# Altium project NANORACK_LASER.PrjPcb
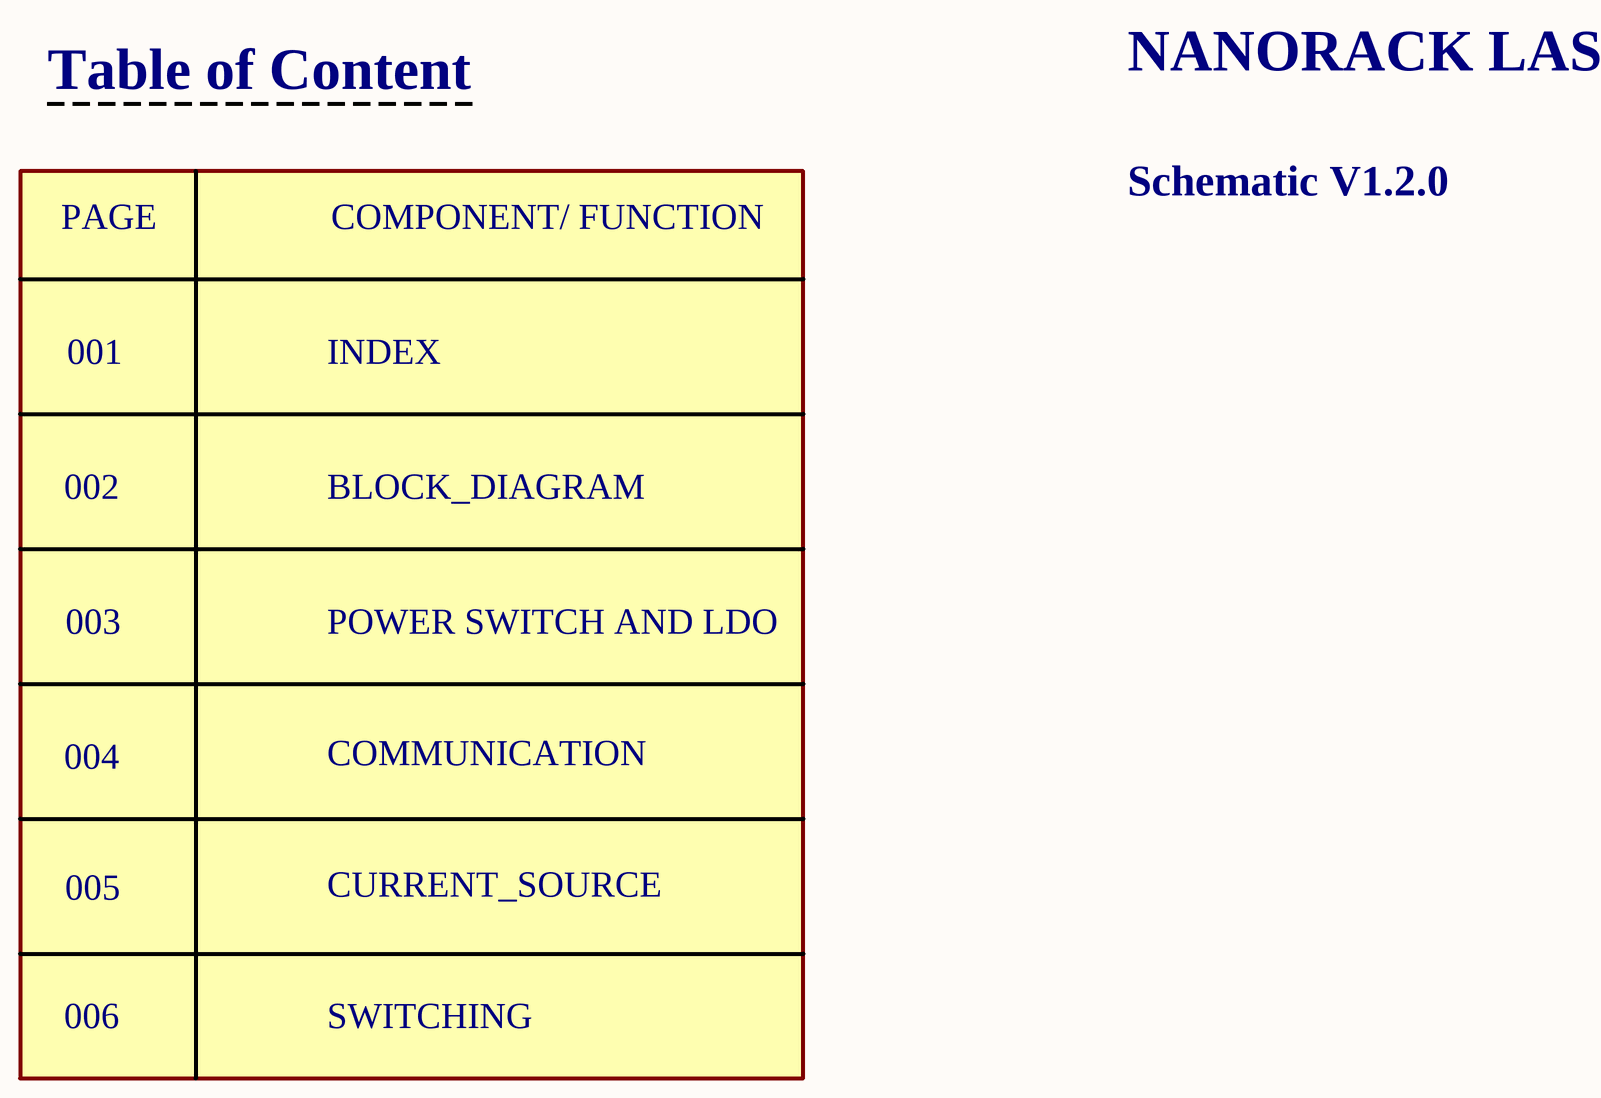
[diagram p0: INDEX.SchDoc]
6 sheets, 191 parts. Net scope: global (net labels, ports and power ports of the same name join across sheets).
Board file: LASERDIODE_V1.2.0.PcbDoc
Sheets:
  INDEX.SchDoc
  BLOCK_DIAGRAM.SchDoc
  POWER SWITCH AND LDO.SchDoc
  COMMUNICATION.SchDoc
  CURRENT_SOURCE.SchDoc
  SWITCHING.SchDoc

## Sheet INDEX.SchDoc
size 420 x 297 mm; SheetNumber: 1; SheetTotal: 6

### Notes on the sheet
- Table of Content
- NANORACK LASER
- PAGE
- COMPONENT/ FUNCTION
- Schematic V1.2.0
- 001
- INDEX
- 002
- BLOCK_DIAGRAM
- 003
- POWER SWITCH AND LDO
- 004
- COMMUNICATION
- 005
- CURRENT_SOURCE
- 006
- SWITCHING
- Project:
- BEE-PC1
- Sub-system:
- Design by:
- Hung Nguyen D.
- Bao Bui Q.
- Sheet title:
- Sheet
- A3
- of
- Checked by:
- Approved by:
- Vu Pham
- Revision:
- Document No:
- V1.2.0
- Size:
- Date:

## Sheet BLOCK_DIAGRAM.SchDoc
size 420 x 297 mm; SheetNumber: 2; SheetTotal: 6

### Notes on the sheet
- Project:
- BEE-PC1
- Sub-system:
- Design by:
- Hung Nguyen D.
- Bao Bui Q.
- Sheet title:
- Sheet
- A3
- of
- Checked by:
- Approved by:
- Vu Pham
- Revision:
- Document No:
- V1.2.0
- Size:
- Date:
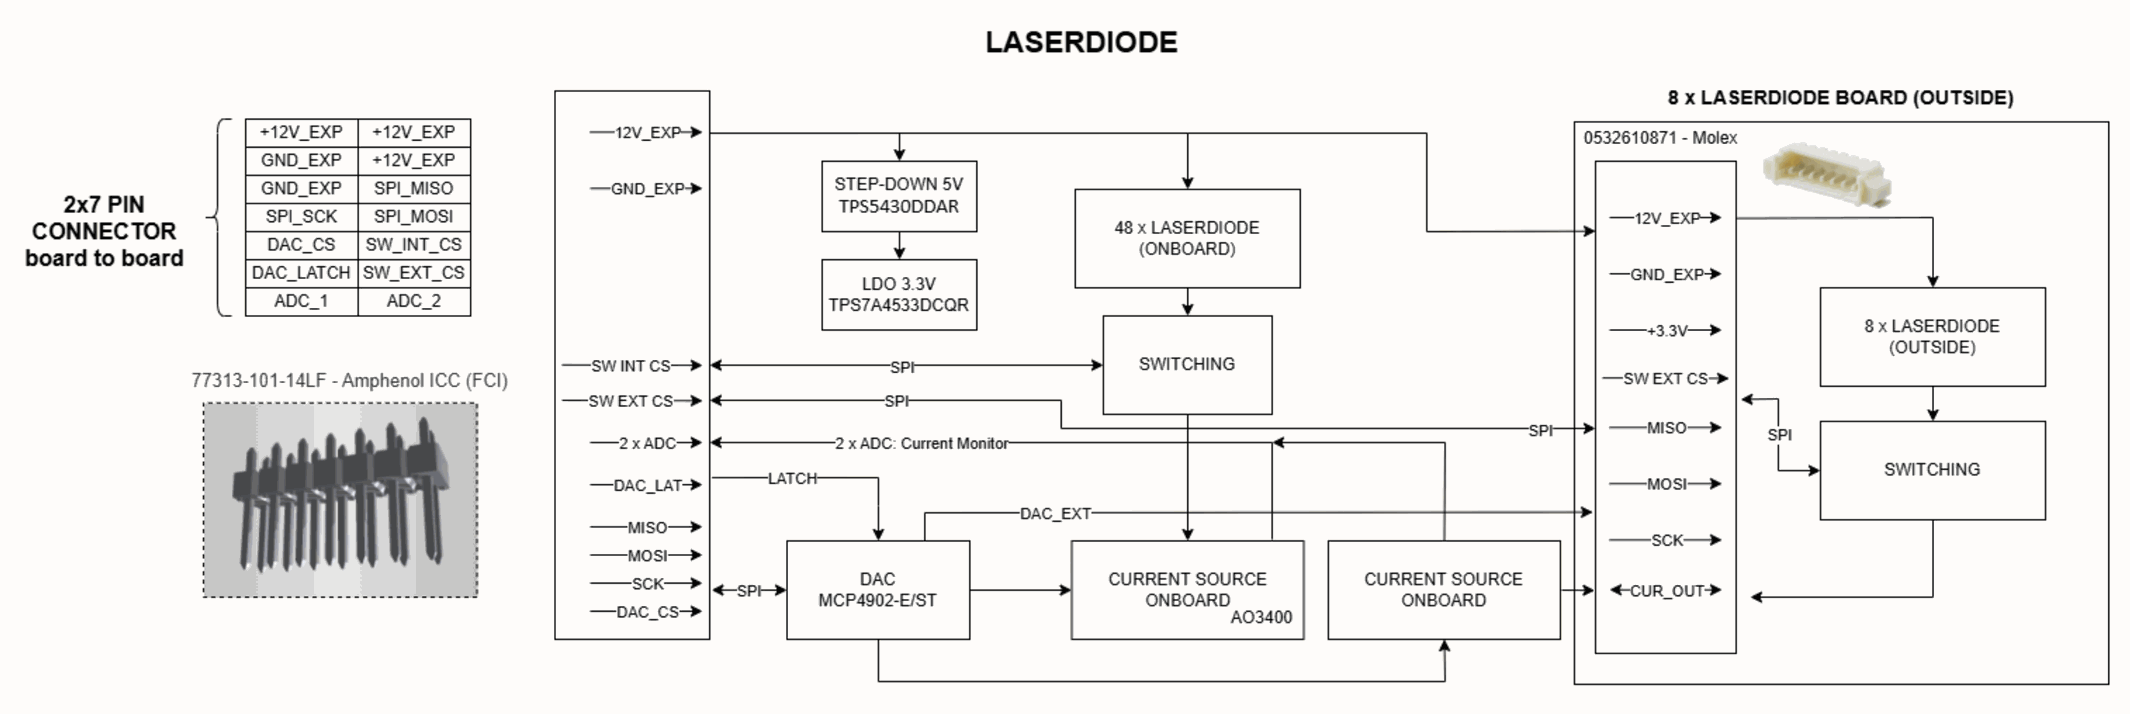
[diagram p1: BLOCK_DIAGRAM.SchDoc]

## Sheet POWER SWITCH AND LDO.SchDoc
size 420 x 297 mm; SheetNumber: 3; SheetTotal: 6
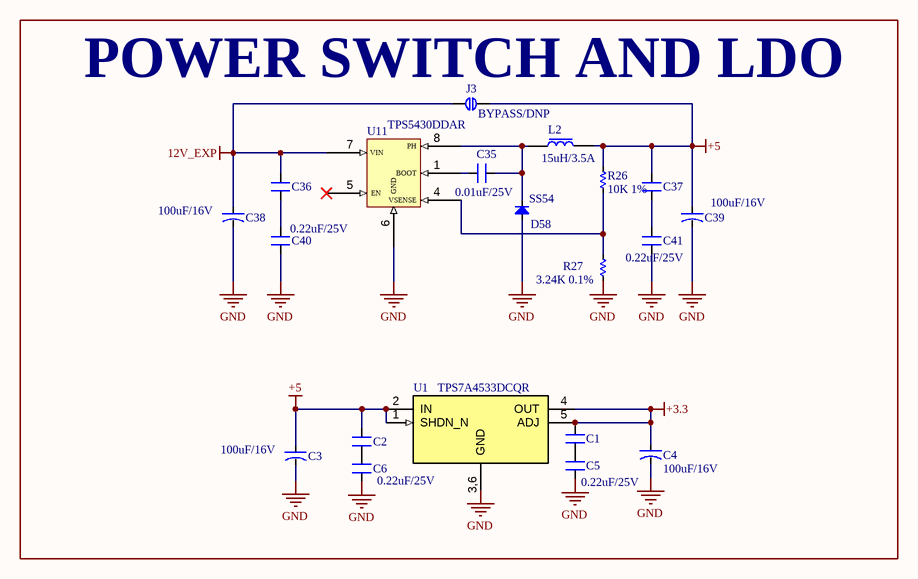
[diagram p2: POWER SWITCH AND LDO.SchDoc]

### Parts
C1  0.22uF/25V  [SM-0603]  (value not drawn)
C2  0.22uF/25V  [SM-0603]
C3  100uF/16V  [CAP TANT 2312]
C4  100uF/16V  [CAP TANT 2312]
C5  0.22uF/25V  [SM-0603]
C6  0.22uF/25V  [SM-0603]  (value not drawn)
C35  0.01uF/25V  [SM-0603]
C36  0.22uF/25V  [SM-0603]  (value not drawn)
C37  0.22uF/25V  [SM-0603]  (value not drawn)
C38  100uF/16V  [CAP TANT 2312]
C39  100uF/16V  [CAP TANT 2312]
C40  0.22uF/25V  [SM-0603]
C41  0.22uF/25V  [SM-0603]
D58  SS54  [DIO-SMD-A]
J3  BYPASS/DNP  [BIG_CONNECTOR]
L2  15uH/3.5A  [SRP7050TA]
R26  10K 1%  [RES-SMD-0603]
R27  3.24K 0.1%  [RES-SMD-0603]
U1  TPS7A4533DCQR  [SOT223-6]
U11  TPS5430DDAR  [HSOP8]

### Blocks framed on the sheet
POWER SWITCH AND LDO: C1-C6 C35-C41 D58 J3 L2 R26 R27 U1 U11

### Nets
12V_EXP: C36.2 C38.1 J3.1 U11.7(VIN)
+3.3: C1.2 C4.1 U1.4(OUT) U1.5(ADJ)
+5: C2.2 C3.1 C37.2 C39.1 J3.2 L2.2 R26.2 U1.1(SHDN_N) U1.2(IN)
GND: C3.2 C4.2 C5.1 C6.1 C38.2 C39.2 C40.1 C41.1 D58.1(A) R27.1 U1.3,6(GND) U11.6(GND)
NetC1_1: C1.1 C5.2
NetC2_1: C2.1 C6.2
NetC35_1: C35.1 D58.2(K) L2.1 U11.8(PH)
NetC35_2: C35.2 U11.1(BOOT)
NetC36_1: C36.1 C40.2
NetC37_1: C37.1 C41.2
NetR26_1: R26.1 R27.2 U11.4(VSENSE)

Not connected (* = marked no-connect by the designer): U11 5(EN)*

### Notes on the sheet
- Project:
- BEE-PC1
- Sub-system:
- Design by:
- Hung Nguyen D.
- Bao Bui Q.
- Sheet title:
- Sheet
- A3
- of
- Checked by:
- Approved by:
- Vu Pham
- Revision:
- Document No:
- V1.2.0
- Size:
- Date:

### Library data of the parts
C1 C2 C5 C6 C35-C37 C40 C41 = CM: 0603; Value: 103
C3 C4 C38 C39 = CN-ALU-SMD: Polarized Capacitor (Axial); Published: 8-Jun-2000; LatestRevisionDate: 17-Jul-2002; LatestRevisionNote: Re-released for DXP Platform.; PackageReference: POLAR0.8; Publisher: Altium Limited
D58 = Diode SMD: DIODE SCHOTTKY 40V 5A SMA; Code - JEDEC: DO-214-AB; Value: 1N5007; Published: 8-Jun-2000; Revision: July-2002: Re-released for DXP Platform.; Publisher: Altium Limited
J3 = CNT: DNP
L2 = INDUCTOR: SRP7050TA-150M
R26 = Res-SMD: 0603; Manufacturer: Generic Components; Class: Passive; Published: 08/06/2000; Publisher: Altium Hobart Technology Centre
R27 = Res-SMD: ERA-3AEB3241V; Manufacturer: Generic Components; Class: Passive; Published: 08/06/2000; Publisher: Altium Hobart Technology Centre
U1 = TPS7A4533DCQR: IC REG LINEAR 3.3V 1.5A SOT223-6
U11 = TPS543X: 8SOP; pin to pad: 6>6+9

## Sheet COMMUNICATION.SchDoc
size 420 x 297 mm; SheetNumber: 4; SheetTotal: 6
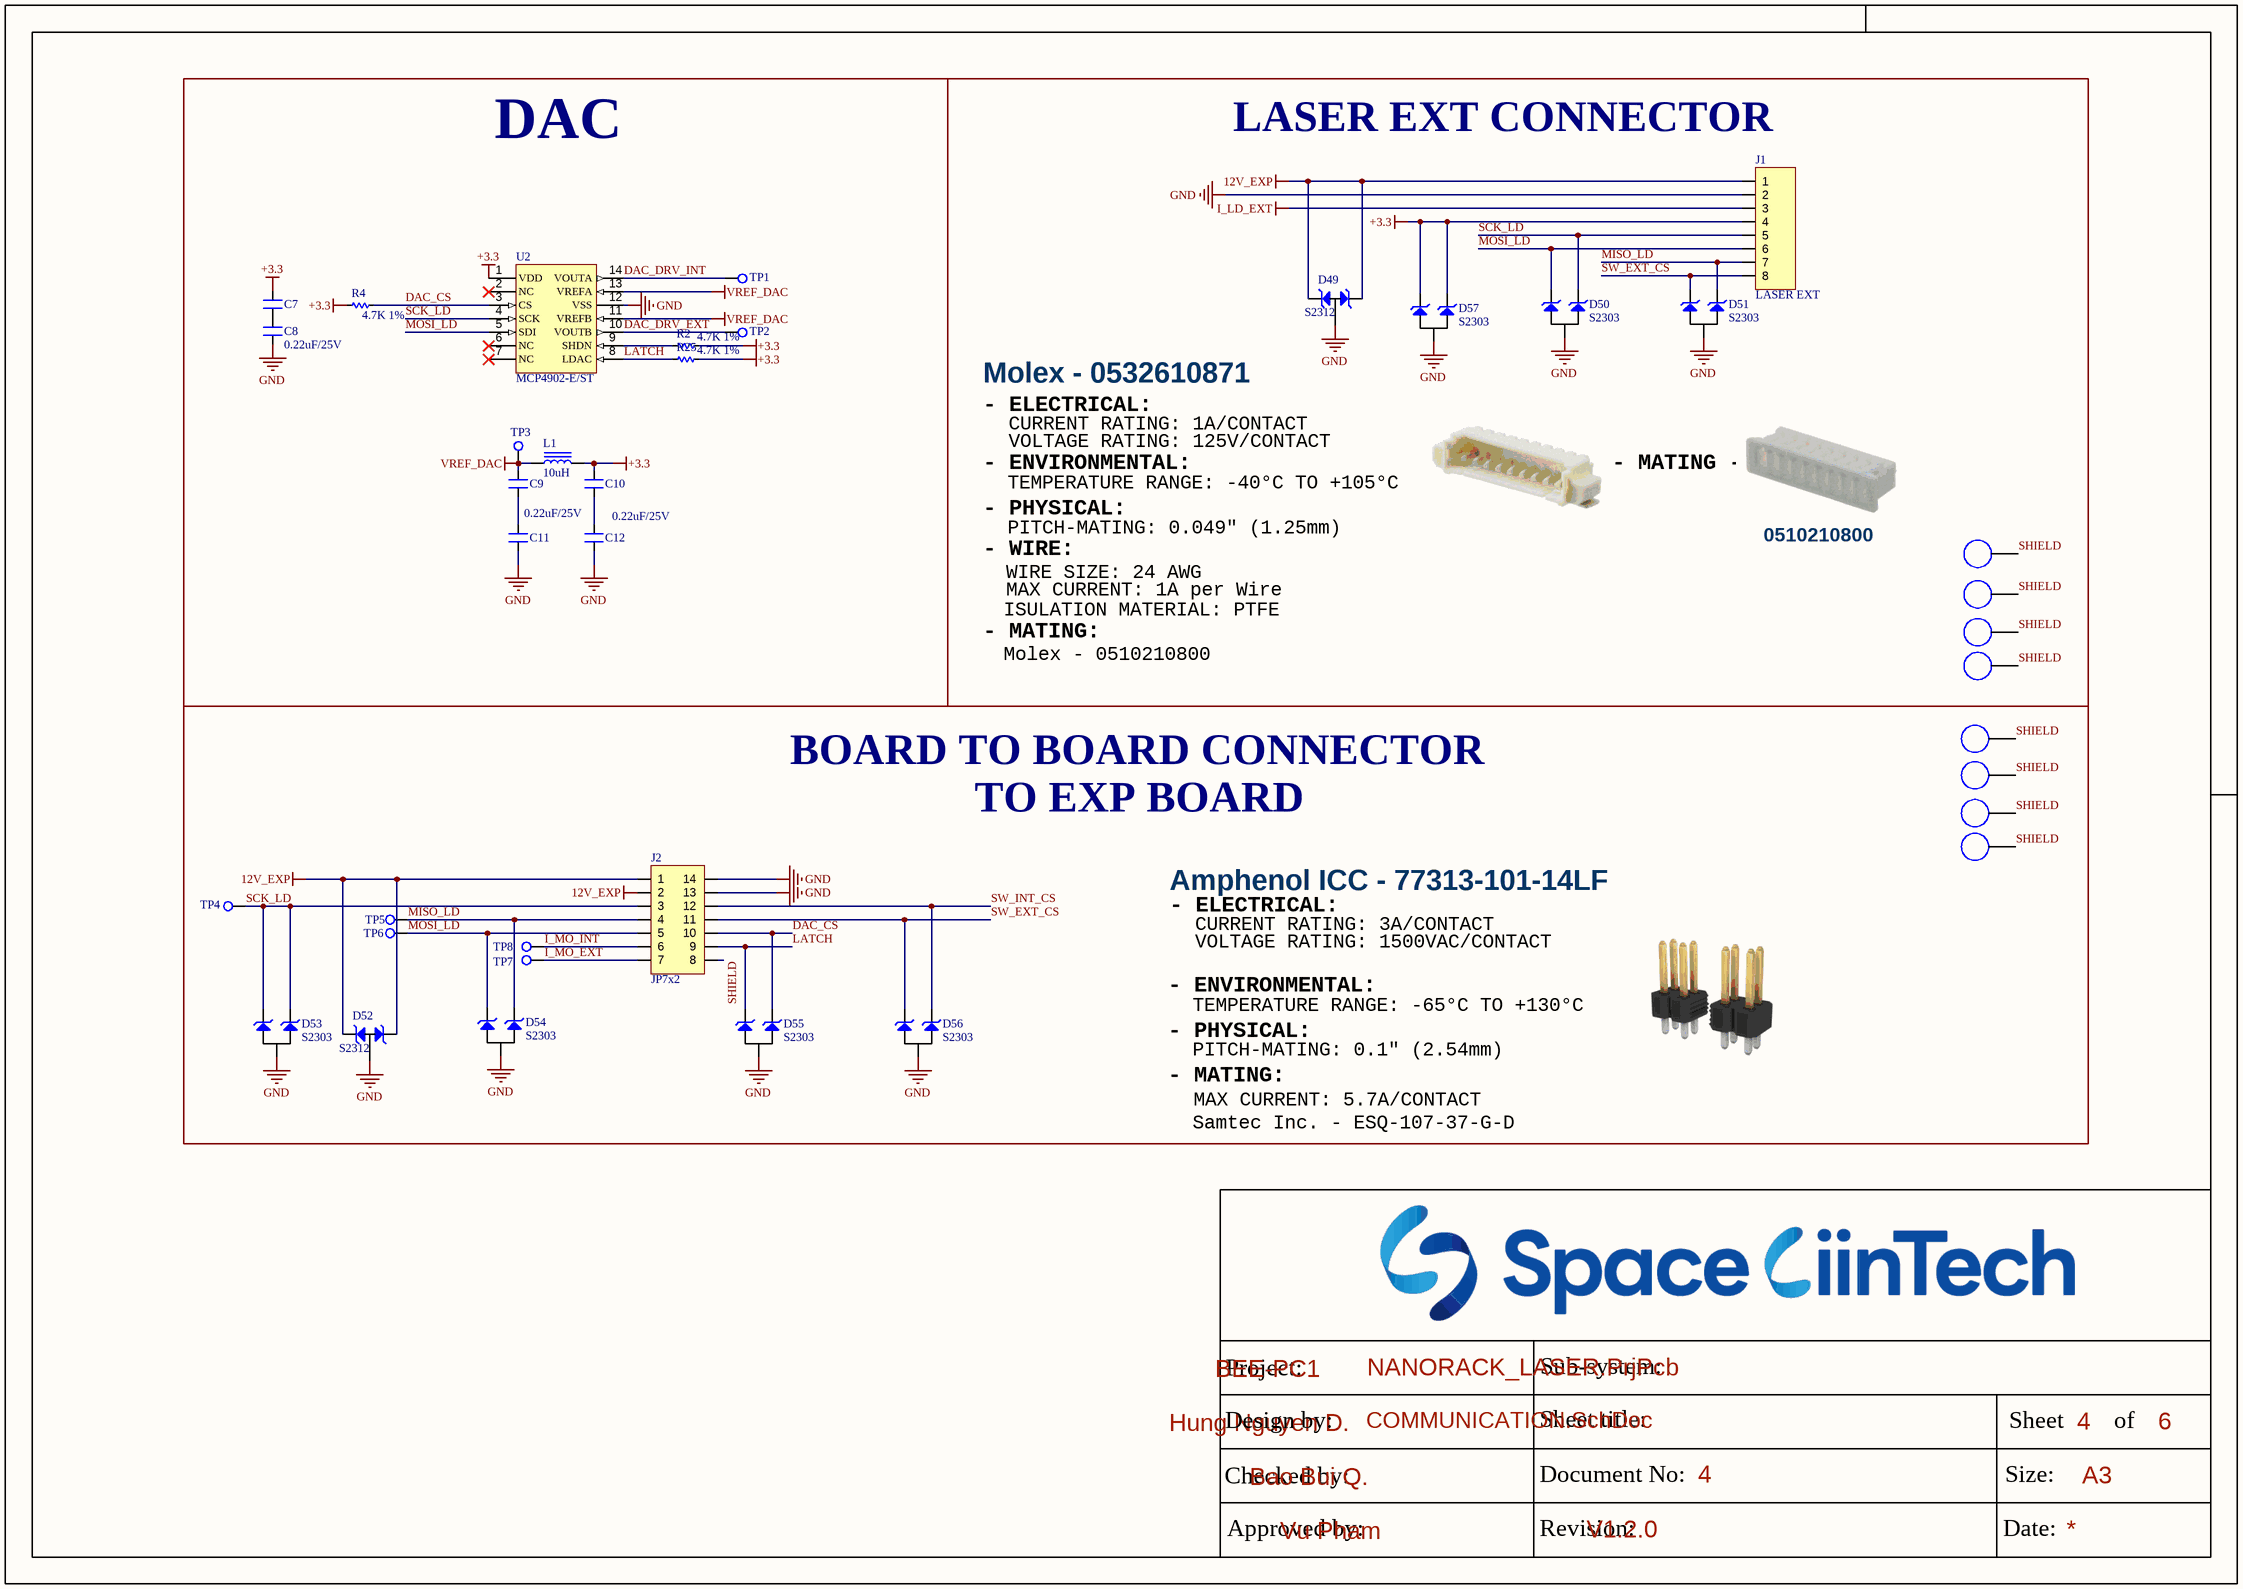
[diagram p3: COMMUNICATION.SchDoc]

### Parts
C7  0.22uF/25V  [SM-0603]  (value not drawn)
C8  0.22uF/25V  [SM-0603]
C9  0.22uF/25V  [SM-0603]  (value not drawn)
C10  0.22uF/25V  [SM-0603]  (value not drawn)
C11  0.22uF/25V  [SM-0603]
C12  0.22uF/25V  [SM-0603]
D49  S2312  [SOT23-123]
D50  S2303  [SOT23-123]
D51  S2303  [SOT23-123]
D52  S2312  [SOT23-123]
D53  S2303  [SOT23-123]
D54  S2303  [SOT23-123]
D55  S2303  [SOT23-123]
D56  S2303  [SOT23-123]
D57  S2303  [SOT23-123]
H1  HOLD  [M3]  (value not drawn)
H2  HOLD  [M3]  (value not drawn)
H3  HOLD  [M3]  (value not drawn)
H4  HOLD  [M3]  (value not drawn)
H5  HOLD  [M3]  (value not drawn)
H6  HOLD  [M3]  (value not drawn)
H7  HOLD  [M3]  (value not drawn)
H8  HOLD  [M3]  (value not drawn)
J1  LASER EXT  [0532610871]
J2  JP7x2  [JP7-D2T]
L1  10uH  [FER 0805/2012]
R2  4.7K 1%  [RES-SMD-0603]
R4  4.7K 1%  [RES-SMD-0603]
R25  4.7K 1%  [RES-SMD-0603]
TP1  Test_Point  [TESTPOINT]  (value not drawn)
TP2  Test_Point  [TESTPOINT]  (value not drawn)
TP3  Test_Point  [TESTPOINT]  (value not drawn)
TP4  Test_Point  [TESTPOINT]  (value not drawn)
TP5  Test_Point  [TESTPOINT]  (value not drawn)
TP6  Test_Point  [TESTPOINT]  (value not drawn)
TP7  Test_Point  [TESTPOINT]  (value not drawn)
TP8  Test_Point  [TESTPOINT]  (value not drawn)
U2  MCP4902-E/ST  [TSSOP14]

### Blocks framed on the sheet
DAC: C7-C12 L1 R2 R4 R25 TP1-TP3 U2
LASER EXT CONNECTOR: D49-D51 D57 H1-H3 H8 J1

### Nets
12V_EXP: D49.1 D49.3 D52.1 D52.3 J1.1 J2.1 J2.2
+3.3: C7.2 C10.2 D57.1 D57.3 J1.4 L1.2 R2.1 R4.2 R25.1 U2.1(VDD)
GND: C8.1 C11.1 C12.1 D49.2 D50.2 D51.2 D52.2 D53.2 D54.2 D55.2 D56.2 D57.2 J1.2 J2.13 J2.14 U2.12(VSS)
I_LD_EXT: J1.3
VREF_DAC: C9.2 L1.1 TP3.1 U2.11(VREFB) U2.13(VREFA)
DAC_CS: D55.3 J2.10 R4.1 U2.3(CS)
DAC_DRV_EXT: TP2.1 U2.10(VOUTB)
DAC_DRV_INT: TP1.1 U2.14(VOUTA)
I_MO_EXT: J2.7 TP7.1
I_MO_INT: J2.6 TP8.1
LATCH: D55.1 J2.9 R25.2 U2.8(LDAC)
MISO_LD: D51.3 D54.3 J1.7 J2.4 TP5.1
MOSI_LD: D50.1 D54.1 J1.6 J2.5 TP6.1 U2.5(SDI)
SCK_LD: D50.3 D53.1 D53.3 J1.5 J2.3 TP4.1 U2.4(SCK)
SHIELD: H1.1 H2.1 H3.1 H4.1 H5.1 H6.1 H7.1 H8.1 J2.8
SW_EXT_CS: D51.1 D56.1 J1.8 J2.11
SW_INT_CS: D56.3 J2.12
NetC7_1: C7.1 C8.2
NetC9_1: C9.1 C11.2
NetC10_1: C10.1 C12.2
NetR2_2: R2.2 U2.9(SHDN)

Not connected (* = marked no-connect by the designer): U2 2(NC)* 6(NC)* 7(NC)*

### Notes on the sheet
- Molex - 0532610871
- - ELECTRICAL:
- CURRENT RATING: 1A/CONTACT
- VOLTAGE RATING: 125V/CONTACT
- - ENVIRONMENTAL:
- - PHYSICAL:
- TEMPERATURE RANGE: -40°C TO +105°C
- - MATING -
- - WIRE:
- WIRE SIZE: 24 AWG
- MAX CURRENT: 1A per Wire
- PITCH-MATING: 0.049" (1.25mm)
- 0510210800
- - MATING:
- ISULATION MATERIAL: PTFE
- Molex - 0510210800
- BOARD TO BOARD CONNECTOR
- TO EXP BOARD
- Amphenol ICC - 77313-101-14LF
- CURRENT RATING: 3A/CONTACT
- VOLTAGE RATING: 1500VAC/CONTACT
- TEMPERATURE RANGE: -65°C TO +130°C
- PITCH-MATING: 0.1" (2.54mm)
- Samtec Inc. - ESQ-107-37-G-D
- MAX CURRENT: 5.7A/CONTACT
- Project:
- BEE-PC1
- Sub-system:
- Design by:
- Hung Nguyen D.
- Bao Bui Q.
- Sheet title:
- Sheet
- A3
- of
- Checked by:
- Approved by:
- Vu Pham
- Revision:
- Document No:
- V1.2.0
- Size:
- Date:

### Library data of the parts
C7-C12 = CM: 0603; Value: 103
D49 D52 = S2315: TVS DIODE 12VWM 19VC SOT23, P/N:  S2312
D50 D51 D53-D57 = S2303: TVS DIODE 3.3VWM 8VC SOT23, P/N: / S2303
H1-H8 = PAD_HOLD
J1 = JP8: WR-PHD 2.54 mm Angled Socket Header; Manufacturer: W¨¹rth Elektronik eiSos GmbH; partNo: 613008143121; ComponentLink1 Description: Manufacturer; ComponentLink2 Description: Datasheet; NoPins: 08; Created Date: 29 March 2013; ComponentLink1URL: http://www.we-online.com; ComponentLink2URL: http://katalog.we-online.de/em/datasheet/6130xx143121.pdf; Created by: Karrer Zheng
J2 = JP7x2: WR-PHD 2.54 mm Dual Socket Header; Manufacturer: W¨¹rth Elektronik eiSos GmbH; partNo: 61301421821; ComponentLink1 Description: Manufacturer; ComponentLink2 Description: Datasheet; NoPins: 14; Created Date: 29 March 2013; ComponentLink1URL: http://www.we-online.com; ComponentLink2URL: http://katalog.we-online.de/em/datasheet/6130xx21821.pdf; Created by: Karrer Zheng
L1 = Inductor: MLZ1608N100LT000; Value: 1.5uH
R2 R4 R25 = Res-SMD: as R26 on sheet POWER SWITCH AND LDO; Published: 08/06/2000; Publisher: Altium Hobart Technology Centre
U2 = MCP4902: IC DAC 8BIT V-OUT 14TSSOP

## Sheet CURRENT_SOURCE.SchDoc
size 420 x 297 mm; SheetNumber: 5; SheetTotal: 6
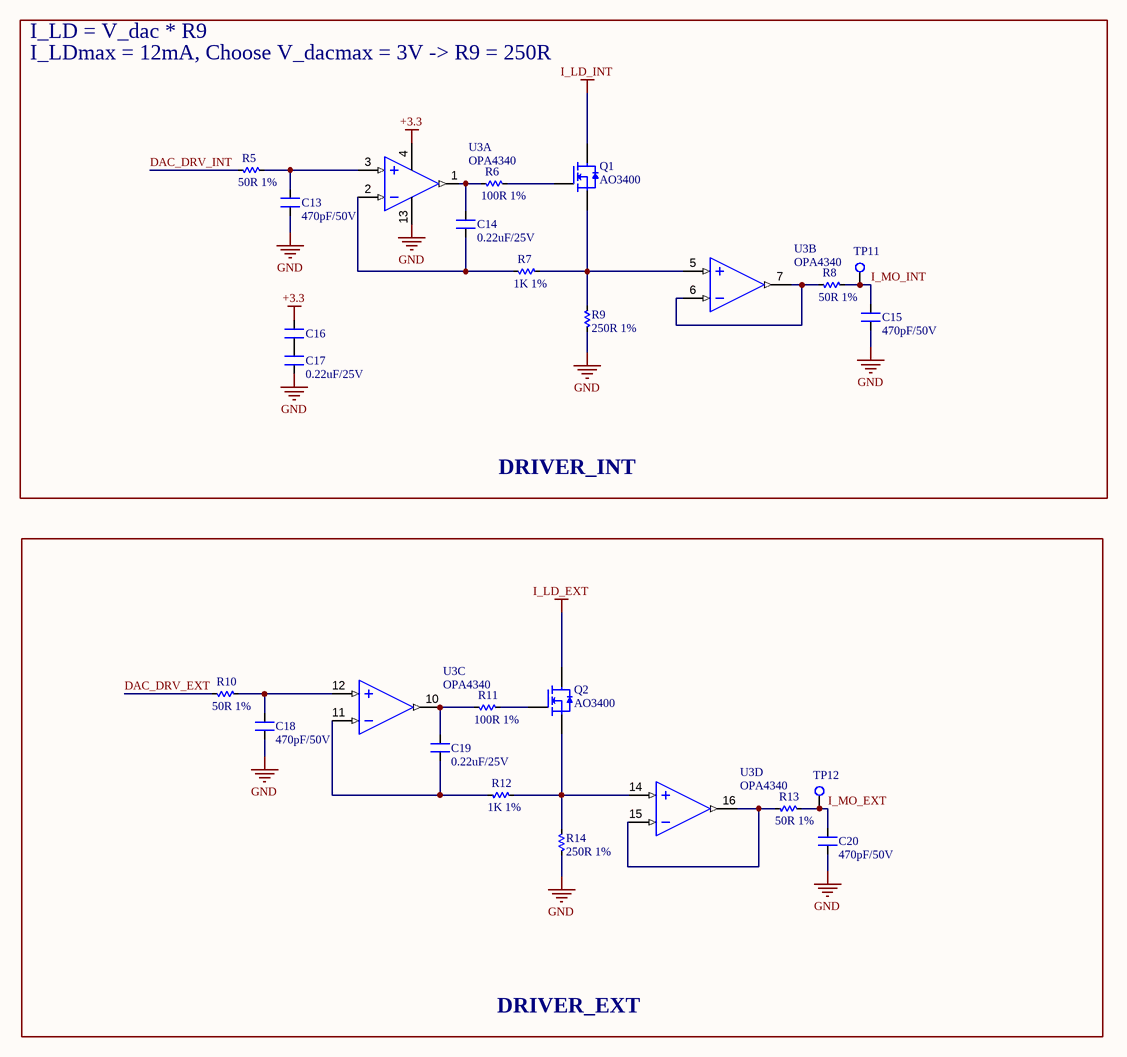
[diagram p4: CURRENT_SOURCE.SchDoc]

### Parts
C13  470pF/50V  [SM-0603]
C14  0.22uF/25V  [SM-0603]
C15  470pF/50V  [SM-0603]
C16  0.22uF/25V  [SM-0603]  (value not drawn)
C17  0.22uF/25V  [SM-0603]
C18  470pF/50V  [SM-0603]
C19  0.22uF/25V  [SM-0603]
C20  470pF/50V  [SM-0603]
Q1  AO3400  [SOT23-132]
Q2  AO3400  [SOT23-132]
R5  50R 1%  [RES-SMD-0603]
R6  100R 1%  [RES-SMD-0603]
R7  1K 1%  [RES-SMD-0603]
R8  50R 1%  [RES-SMD-0603]
R9  250R 1%  [RES-SMD-1206]
R10  50R 1%  [RES-SMD-0603]
R11  100R 1%  [RES-SMD-0603]
R12  1K 1%  [RES-SMD-0603]
R13  50R 1%  [RES-SMD-0603]
R14  250R 1%  [RES-SMD-1206]
TP11  Test_Point  [TESTPOINT]  (value not drawn)
TP12  Test_Point  [TESTPOINT]  (value not drawn)
U3  OPA4340  [SSOP16]  (parts A,B,C,D of 4)

### Blocks framed on the sheet
DRIVER_EXT: C18-C20 Q2 R10-R14 TP12 U3

### Nets
+3.3: C16.2 U3.4(+V)
GND: C13.1 C15.1 C17.1 C18.1 C20.1 R9.1 R14.1 U3.13(-V)
I_LD_EXT: Q2.3
I_LD_INT: Q1.3
DAC_DRV_EXT: R10.1
DAC_DRV_INT: R5.1
I_MO_EXT: C20.2 R13.2 TP12.1
I_MO_INT: C15.2 R8.2 TP11.1
NetC13_2: C13.2 R5.2 U3.3(IN+)
NetC14_1: C14.1 R7.1 U3.2(IN-)
NetC14_2: C14.2 R6.1 U3.1(OUT)
NetC16_1: C16.1 C17.2
NetC18_2: C18.2 R10.2 U3.12(IN+)
NetC19_1: C19.1 R12.1 U3.11(IN-)
NetC19_2: C19.2 R11.1 U3.10(OUT)
NetQ1_1: Q1.1 R6.2
NetQ1_2: Q1.2 R7.2 R9.2 U3.5(IN+)
NetQ2_1: Q2.1 R11.2
NetQ2_2: Q2.2 R12.2 R14.2 U3.14(IN+)
NetR8_1: R8.1 U3.6(IN-) U3.7(OUT)
NetR13_1: R13.1 U3.15(IN-) U3.16(OUT)

### Notes on the sheet
- I_LD = V_dac * R9
- I_LDmax = 12mA, Choose V_dacmax = 3V -> R9 = 250R
- DRIVER_INT
- Project:
- BEE-PC1
- Sub-system:
- Design by:
- Hung Nguyen D.
- Bao Bui Q.
- Sheet title:
- Sheet
- A3
- of
- Checked by:
- Approved by:
- Vu Pham
- Revision:
- Document No:
- V1.2.0
- Size:
- Date:

### Library data of the parts
C13-C20 = CM: 0603; Value: 103
Q1 Q2 = FET-N
R5-R8 R10-R14 = Res-SMD: as R26 on sheet POWER SWITCH AND LDO; Published: 08/06/2000; Publisher: Altium Hobart Technology Centre
R9 = Res-SMD: 1206; Manufacturer: Generic Components; Class: Passive; Published: 08/06/2000; Publisher: Altium Hobart Technology Centre
U3 = OPA4340: IC CMOS 4 CIRCUIT 16SSOP; Supplier 1: Mouser; Supplier Part Number 1: 595-OPA4340UA/2K5

## Sheet SWITCHING.SchDoc
size 420 x 297 mm; SheetNumber: 6; SheetTotal: 6
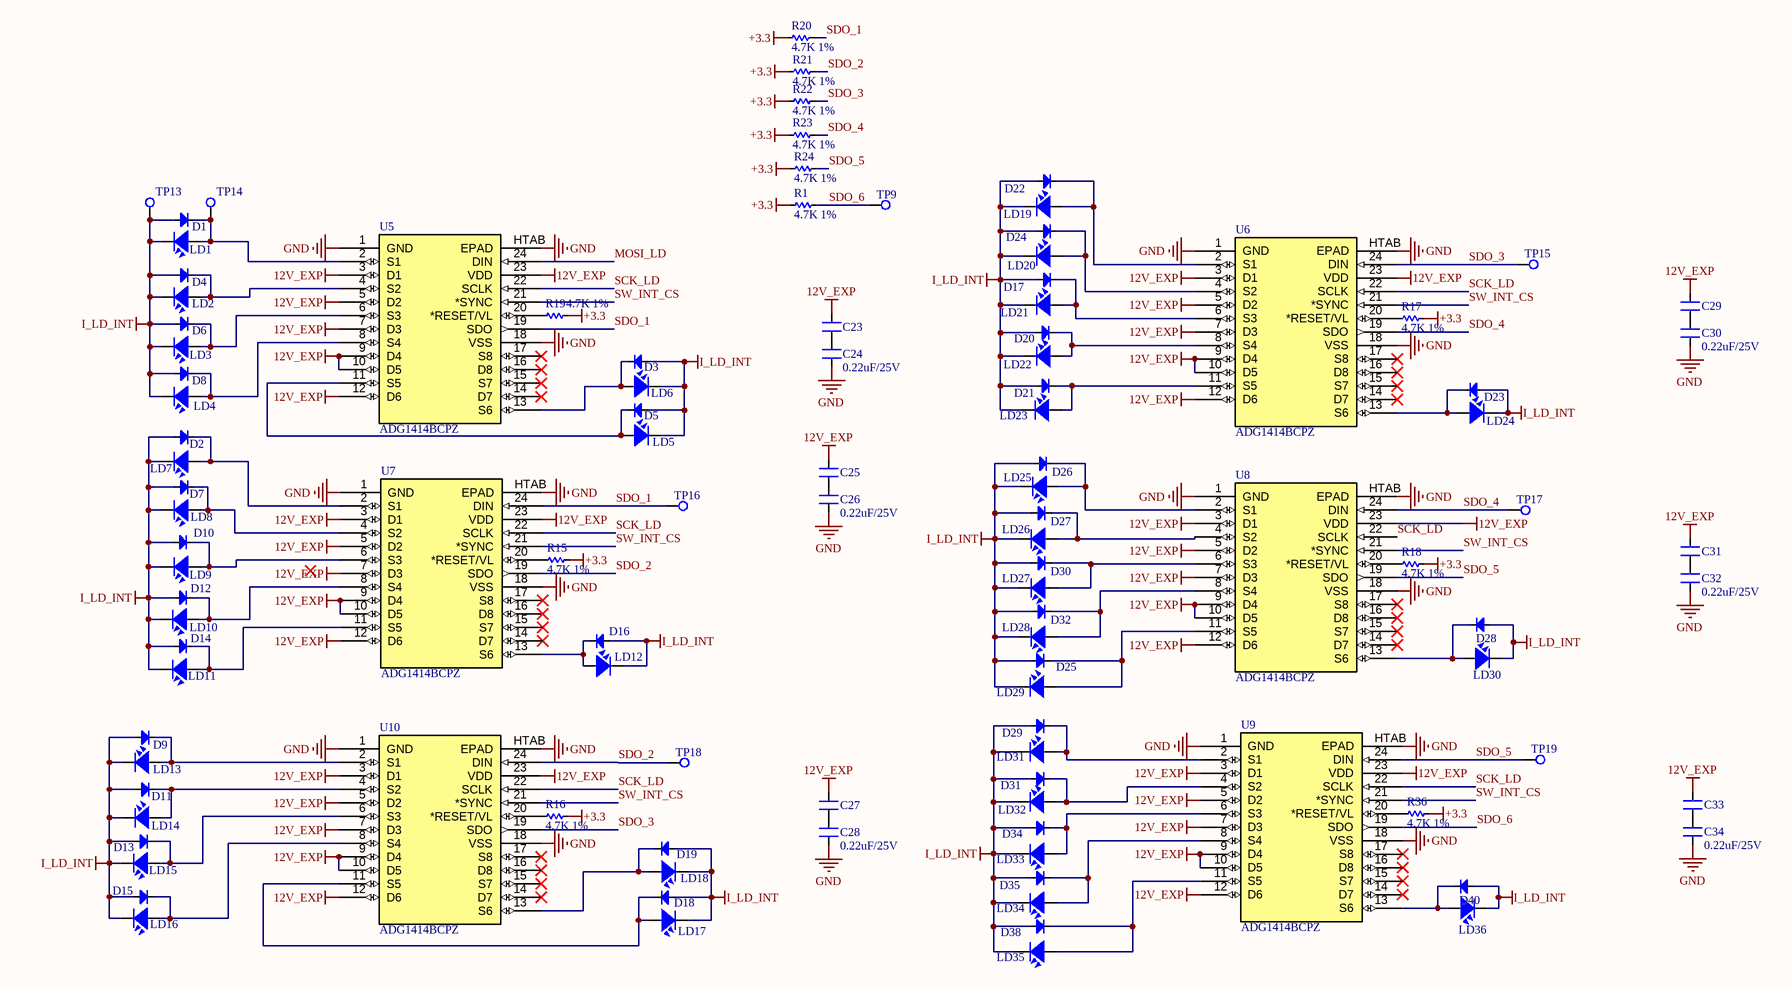
[diagram p5: SWITCHING.SchDoc]

### Parts
C23  0.22uF/25V  [SM-0603]  (value not drawn)
C24  0.22uF/25V  [SM-0603]
C25  0.22uF/25V  [SM-0603]  (value not drawn)
C26  0.22uF/25V  [SM-0603]
C27  0.22uF/25V  [SM-0603]  (value not drawn)
C28  0.22uF/25V  [SM-0603]
C29  0.22uF/25V  [SM-0603]  (value not drawn)
C30  0.22uF/25V  [SM-0603]
C31  0.22uF/25V  [SM-0603]  (value not drawn)
C32  0.22uF/25V  [SM-0603]
C33  0.22uF/25V  [SM-0603]  (value not drawn)
C34  0.22uF/25V  [SM-0603]
D1  1N4148W-TP  [SOD23]  (value not drawn)
D2  1N4148W-TP  [SOD23]  (value not drawn)
D3  1N4148W-TP  [SOD23]  (value not drawn)
D4  1N4148W-TP  [SOD23]  (value not drawn)
D5  1N4148W-TP  [SOD23]  (value not drawn)
D6  1N4148W-TP  [SOD23]  (value not drawn)
D7  1N4148W-TP  [SOD23]  (value not drawn)
D8  1N4148W-TP  [SOD23]  (value not drawn)
D9  1N4148W-TP  [SOD23]  (value not drawn)
D10  1N4148W-TP  [SOD23]  (value not drawn)
D11  1N4148W-TP  [SOD23]  (value not drawn)
D12  1N4148W-TP  [SOD23]  (value not drawn)
D13  1N4148W-TP  [SOD23]  (value not drawn)
D14  1N4148W-TP  [SOD23]  (value not drawn)
D15  1N4148W-TP  [SOD23]  (value not drawn)
D16  1N4148W-TP  [SOD23]  (value not drawn)
D17  1N4148W-TP  [SOD23]  (value not drawn)
D18  1N4148W-TP  [SOD23]  (value not drawn)
D19  1N4148W-TP  [SOD23]  (value not drawn)
D20  1N4148W-TP  [SOD23]  (value not drawn)
D21  1N4148W-TP  [SOD23]  (value not drawn)
D22  1N4148W-TP  [SOD23]  (value not drawn)
D23  1N4148W-TP  [SOD23]  (value not drawn)
D24  1N4148W-TP  [SOD23]  (value not drawn)
D25  1N4148W-TP  [SOD23]  (value not drawn)
D26  1N4148W-TP  [SOD23]  (value not drawn)
D27  1N4148W-TP  [SOD23]  (value not drawn)
D28  1N4148W-TP  [SOD23]  (value not drawn)
D29  1N4148W-TP  [SOD23]  (value not drawn)
D30  1N4148W-TP  [SOD23]  (value not drawn)
D31  1N4148W-TP  [SOD23]  (value not drawn)
D32  1N4148W-TP  [SOD23]  (value not drawn)
D34  1N4148W-TP  [SOD23]  (value not drawn)
D35  1N4148W-TP  [SOD23]  (value not drawn)
D38  1N4148W-TP  [SOD23]  (value not drawn)
D40  1N4148W-TP  [SOD23]  (value not drawn)
LD1  LaserDiode  [LASER_SOCKET]  (value not drawn)
LD2  LaserDiode  [LASER_SOCKET]  (value not drawn)
LD3  LaserDiode  [LASER_SOCKET]  (value not drawn)
LD4  LaserDiode  [LASER_SOCKET]  (value not drawn)
LD5  LaserDiode  [LASER_SOCKET]  (value not drawn)
LD6  LaserDiode  [LASER_SOCKET]  (value not drawn)
LD7  LaserDiode  [LASER_SOCKET]  (value not drawn)
LD8  LaserDiode  [LASER_SOCKET]  (value not drawn)
LD9  LaserDiode  [LASER_SOCKET]  (value not drawn)
LD10  LaserDiode  [LASER_SOCKET]  (value not drawn)
LD11  LaserDiode  [LASER_SOCKET]  (value not drawn)
LD12  LaserDiode  [LASER_SOCKET]  (value not drawn)
LD13  LaserDiode  [LASER_SOCKET]  (value not drawn)
LD14  LaserDiode  [LASER_SOCKET]  (value not drawn)
LD15  LaserDiode  [LASER_SOCKET]  (value not drawn)
LD16  LaserDiode  [LASER_SOCKET]  (value not drawn)
LD17  LaserDiode  [LASER_SOCKET]  (value not drawn)
LD18  LaserDiode  [LASER_SOCKET]  (value not drawn)
LD19  LaserDiode  [LASER_SOCKET]  (value not drawn)
LD20  LaserDiode  [LASER_SOCKET]  (value not drawn)
LD21  LaserDiode  [LASER_SOCKET]  (value not drawn)
LD22  LaserDiode  [LASER_SOCKET]  (value not drawn)
LD23  LaserDiode  [LASER_SOCKET]  (value not drawn)
LD24  LaserDiode  [LASER_SOCKET]  (value not drawn)
LD25  LaserDiode  [LASER_SOCKET]  (value not drawn)
LD26  LaserDiode  [LASER_SOCKET]  (value not drawn)
LD27  LaserDiode  [LASER_SOCKET]  (value not drawn)
LD28  LaserDiode  [LASER_SOCKET]  (value not drawn)
LD29  LaserDiode  [LASER_SOCKET]  (value not drawn)
LD30  LaserDiode  [LASER_SOCKET]  (value not drawn)
LD31  LaserDiode  [LASER_SOCKET]  (value not drawn)
LD32  LaserDiode  [LASER_SOCKET]  (value not drawn)
LD33  LaserDiode  [LASER_SOCKET]  (value not drawn)
LD34  LaserDiode  [LASER_SOCKET]  (value not drawn)
LD35  LaserDiode  [LASER_SOCKET]  (value not drawn)
LD36  LaserDiode  [LASER_SOCKET]  (value not drawn)
R1  4.7K 1%  [RES-SMD-0603]
R15  4.7K 1%  [RES-SMD-0603]
R16  4.7K 1%  [RES-SMD-0603]
R17  4.7K 1%  [RES-SMD-0603]
R18  4.7K 1%  [RES-SMD-0603]
R19  4.7K 1%  [RES-SMD-0603]
R20  4.7K 1%  [RES-SMD-0603]
R21  4.7K 1%  [RES-SMD-0603]
R22  4.7K 1%  [RES-SMD-0603]
R23  4.7K 1%  [RES-SMD-0603]
R24  4.7K 1%  [RES-SMD-0603]
R36  4.7K 1%  [RES-SMD-0603]
TP9  Test_Point  [TESTPOINT]  (value not drawn)
TP13  Test_Point  [TESTPOINT]  (value not drawn)
TP14  Test_Point  [TESTPOINT]  (value not drawn)
TP15  Test_Point  [TESTPOINT]  (value not drawn)
TP16  Test_Point  [TESTPOINT]  (value not drawn)
TP17  Test_Point  [TESTPOINT]  (value not drawn)
TP18  Test_Point  [TESTPOINT]  (value not drawn)
TP19  Test_Point  [TESTPOINT]  (value not drawn)
U5  ADG1414BCPZ  [ADG1414BCPZ]
U6  ADG1414BCPZ  [ADG1414BCPZ]
U7  ADG1414BCPZ  [ADG1414BCPZ]
U8  ADG1414BCPZ  [ADG1414BCPZ]
U9  ADG1414BCPZ  [ADG1414BCPZ]
U10  ADG1414BCPZ  [ADG1414BCPZ]

### Nets
12V_EXP: C23.2 C25.2 C27.2 C29.2 C31.2 C33.2 U5.3(D1) U5.5(D2) U5.7(D3) U5.9(D4) U5.10(D5) U5.12(D6) U5.23(VDD) U6.3(D1) U6.5(D2) U6.7(D3) U6.9(D4) U6.10(D5) U6.12(D6) U6.23(VDD) U7.3(D1) U7.5(D2) U7.7(D3) U7.9(D4) U7.10(D5) U7.12(D6) U7.23(VDD) U8.3(D1) U8.5(D2) U8.7(D3) U8.9(D4) U8.10(D5) U8.12(D6) U8.23(VDD) U9.3(D1) U9.5(D2) U9.7(D3) U9.9(D4) U9.10(D5) U9.12(D6) U9.23(VDD) U10.3(D1) U10.5(D2) U10.7(D3) U10.9(D4) U10.10(D5) U10.12(D6) U10.23(VDD)
+3.3: R1.2 R15.2 R16.2 R17.2 R18.2 R19.2 R20.2 R21.2 R22.2 R23.2 R24.2 R36.2
GND: C24.1 C26.1 C28.1 C30.1 C32.1 C34.1 U5.1(GND) U5.18(VSS) U5.HTAB(EPAD) U6.1(GND) U6.18(VSS) U6.HTAB(EPAD) U7.1(GND) U7.18(VSS) U7.HTAB(EPAD) U8.1(GND) U8.18(VSS) U8.HTAB(EPAD) U9.1(GND) U9.18(VSS) U9.HTAB(EPAD) U10.1(GND) U10.18(VSS) U10.HTAB(EPAD)
I_LD_INT: D1.1(A) D2.1(A) D3.1(A) D4.1(A) D5.1(A) D6.1(A) D7.1(A) D8.1(A) D9.1(A) D10.1(A) D11.1(A) D12.1(A) D13.1(A) D14.1(A) D15.1(A) D16.1(A) D17.1(A) D18.1(A) D19.1(A) D20.1(A) D21.1(A) D22.1(A) D23.1(A) D24.1(A) D25.1(A) D26.1(A) D27.1(A) D28.1(A) D29.1(A) D30.1(A) D31.1(A) D32.1(A) D34.1(A) D35.1(A) D38.1(A) D40.1(A) LD1.3 LD2.3 LD3.3 LD4.3 LD5.3 LD6.3 LD7.3 LD8.3 LD9.3 LD10.3 LD11.3 LD12.3 LD13.3 LD14.3 LD15.3 LD16.3 LD17.3 LD18.3 LD19.3 LD20.3 LD21.3 LD22.3 LD23.3 LD24.3 LD25.3 LD26.3 LD27.3 LD28.3 LD29.3 LD30.3 LD31.3 LD32.3 LD33.3 LD34.3 LD35.3 LD36.3 TP13.1
MOSI_LD: U5.24(DIN)
SCK_LD: U5.22(SCLK) U6.22(SCLK) U7.22(SCLK) U8.22(SCLK) U9.22(SCLK) U10.22(SCLK)
SDO_1: R20.1 TP16.1 U5.19(SDO) U7.24(DIN)
SDO_2: R21.1 TP18.1 U7.19(SDO) U10.24(DIN)
SDO_3: R22.1 TP15.1 U6.24(DIN) U10.19(SDO)
SDO_4: R23.1 TP17.1 U6.19(SDO) U8.24(DIN)
SDO_5: R24.1 TP19.1 U8.19(SDO) U9.24(DIN)
SDO_6: R1.1 TP9.1 U9.19(SDO)
SW_INT_CS: U5.21(*SYNC) U6.21(*SYNC) U7.21(*SYNC) U8.21(*SYNC) U9.21(*SYNC) U10.21(*SYNC)
NetC23_1: C23.1 C24.2
NetC25_1: C25.1 C26.2
NetC27_1: C27.1 C28.2
NetC29_1: C29.1 C30.2
NetC31_1: C31.1 C32.2
NetC33_1: C33.1 C34.2
NetD1_2: D1.2(K) LD1.1 TP14.1 U5.2(S1)
NetD2_2: D2.2(K) LD7.1 U7.2(S1)
NetD3_2: D3.2(K) LD6.1 U5.13(S6)
NetD4_2: D4.2(K) LD2.1 U5.4(S2)
NetD5_2: D5.2(K) LD5.1 U5.11(S5)
NetD6_2: D6.2(K) LD3.1 U5.6(S3)
NetD7_2: D7.2(K) LD8.1 U7.4(S2)
NetD8_2: D8.2(K) LD4.1 U5.8(S4)
NetD9_2: D9.2(K) LD13.1 U10.2(S1)
NetD10_2: D10.2(K) LD9.1 U7.6(S3)
NetD11_2: D11.2(K) LD14.1 U10.4(S2)
NetD12_2: D12.2(K) LD10.1 U7.8(S4)
NetD13_2: D13.2(K) LD15.1 U10.6(S3)
NetD14_2: D14.2(K) LD11.1 U7.11(S5)
NetD15_2: D15.2(K) LD16.1 U10.8(S4)
NetD16_2: D16.2(K) LD12.1 U7.13(S6)
NetD17_2: D17.2(K) LD21.1 U6.6(S3)
NetD18_2: D18.2(K) LD17.1 U10.11(S5)
NetD19_2: D19.2(K) LD18.1 U10.13(S6)
NetD20_2: D20.2(K) LD22.1 U6.8(S4)
NetD21_2: D21.2(K) LD23.1 U6.11(S5)
NetD22_2: D22.2(K) LD19.1 U6.2(S1)
NetD23_2: D23.2(K) LD24.1 U6.13(S6)
NetD24_2: D24.2(K) LD20.1 U6.4(S2)
NetD25_2: D25.2(K) LD29.1 U8.11(S5)
NetD26_2: D26.2(K) LD25.1 U8.2(S1)
NetD27_2: D27.2(K) LD26.1 U8.4(S2)
NetD28_2: D28.2(K) LD30.1 U8.13(S6)
NetD29_2: D29.2(K) LD31.1 U9.2(S1)
NetD30_2: D30.2(K) LD27.1 U8.6(S3)
NetD31_2: D31.2(K) LD32.1 U9.4(S2)
NetD32_2: D32.2(K) LD28.1 U8.8(S4)
NetD34_2: D34.2(K) LD33.1 U9.6(S3)
NetD35_2: D35.2(K) LD34.1 U9.8(S4)
NetD38_2: D38.2(K) LD35.1 U9.11(S5)
NetD40_2: D40.2(K) LD36.1 U9.13(S6)
NetR15_1: R15.1 U7.20(*RESET/VL)
NetR16_1: R16.1 U10.20(*RESET/VL)
NetR17_1: R17.1 U6.20(*RESET/VL)
NetR18_1: R18.1 U8.20(*RESET/VL)
NetR19_1: R19.1 U5.20(*RESET/VL)
NetR36_1: R36.1 U9.20(*RESET/VL)

Not connected (* = marked no-connect by the designer): U5 14(D7)* 15(S7)* 16(D8)* 17(S8)*; U6 14(D7)* 15(S7)* 16(D8)* 17(S8)*; U7 14(D7)* 15(S7)* 16(D8)* 17(S8)*; U8 14(D7)* 15(S7)* 16(D8)* 17(S8)*; U9 14(D7)* 15(S7)* 16(D8)* 17(S8)*; U10 14(D7)* 15(S7)* 16(D8)* 17(S8)*

### Notes on the sheet
- Project:
- BEE-PC1
- Sub-system:
- Design by:
- Hung Nguyen D.
- Bao Bui Q.
- Sheet title:
- Sheet
- A3
- of
- Checked by:
- Approved by:
- Vu Pham
- Revision:
- Document No:
- V1.2.0
- Size:
- Date:

### Library data of the parts
C23-C34 = CM: 0603; Value: 103
D1-D32 D34 D35 D38 D40 = Diode SMD: DIODE GEN PURP 100V 150MA SOD123; Code - JEDEC: DO-214-AB; Value: 1N5007; Published: 8-Jun-2000; Revision: July-2002: Re-released for DXP Platform.; Publisher: Altium Limited
LD1-LD36 = LD: pin to pad: 3>2
R1 R15-R24 R36 = Res-SMD: as R26 on sheet POWER SWITCH AND LDO; Published: 08/06/2000; Publisher: Altium Hobart Technology Centre
U5-U10 = ADG1414: IC SW SPST-NOX8 11.5OHM 24LFCSP

## Nets that join several sheets
12V_EXP: POWER SWITCH AND LDO (C36.2 C38.1 J3.1 U11.7), COMMUNICATION (7 pins), SWITCHING (48 pins)
+3.3: POWER SWITCH AND LDO (C1.2 C4.1 U1.4 U1.5), COMMUNICATION (10 pins), CURRENT_SOURCE (C16.2 U3.4), SWITCHING (12 pins)
GND: POWER SWITCH AND LDO (12 pins), COMMUNICATION (16 pins), CURRENT_SOURCE (8 pins), SWITCHING (24 pins)
I_LD_EXT: COMMUNICATION (J1.3), CURRENT_SOURCE (Q2.3)
I_LD_INT: CURRENT_SOURCE (Q1.3), SWITCHING (73 pins)
DAC_DRV_EXT: COMMUNICATION (TP2.1 U2.10), CURRENT_SOURCE (R10.1)
DAC_DRV_INT: COMMUNICATION (TP1.1 U2.14), CURRENT_SOURCE (R5.1)
I_MO_EXT: COMMUNICATION (J2.7 TP7.1), CURRENT_SOURCE (C20.2 R13.2 TP12.1)
I_MO_INT: COMMUNICATION (J2.6 TP8.1), CURRENT_SOURCE (C15.2 R8.2 TP11.1)
MOSI_LD: COMMUNICATION (6 pins), SWITCHING (U5.24)
SCK_LD: COMMUNICATION (7 pins), SWITCHING (6 pins)
SW_INT_CS: COMMUNICATION (D56.3 J2.12), SWITCHING (6 pins)